# EAGLE design Zio 4 DC Motor Controller (EAGLE 8.4.1)
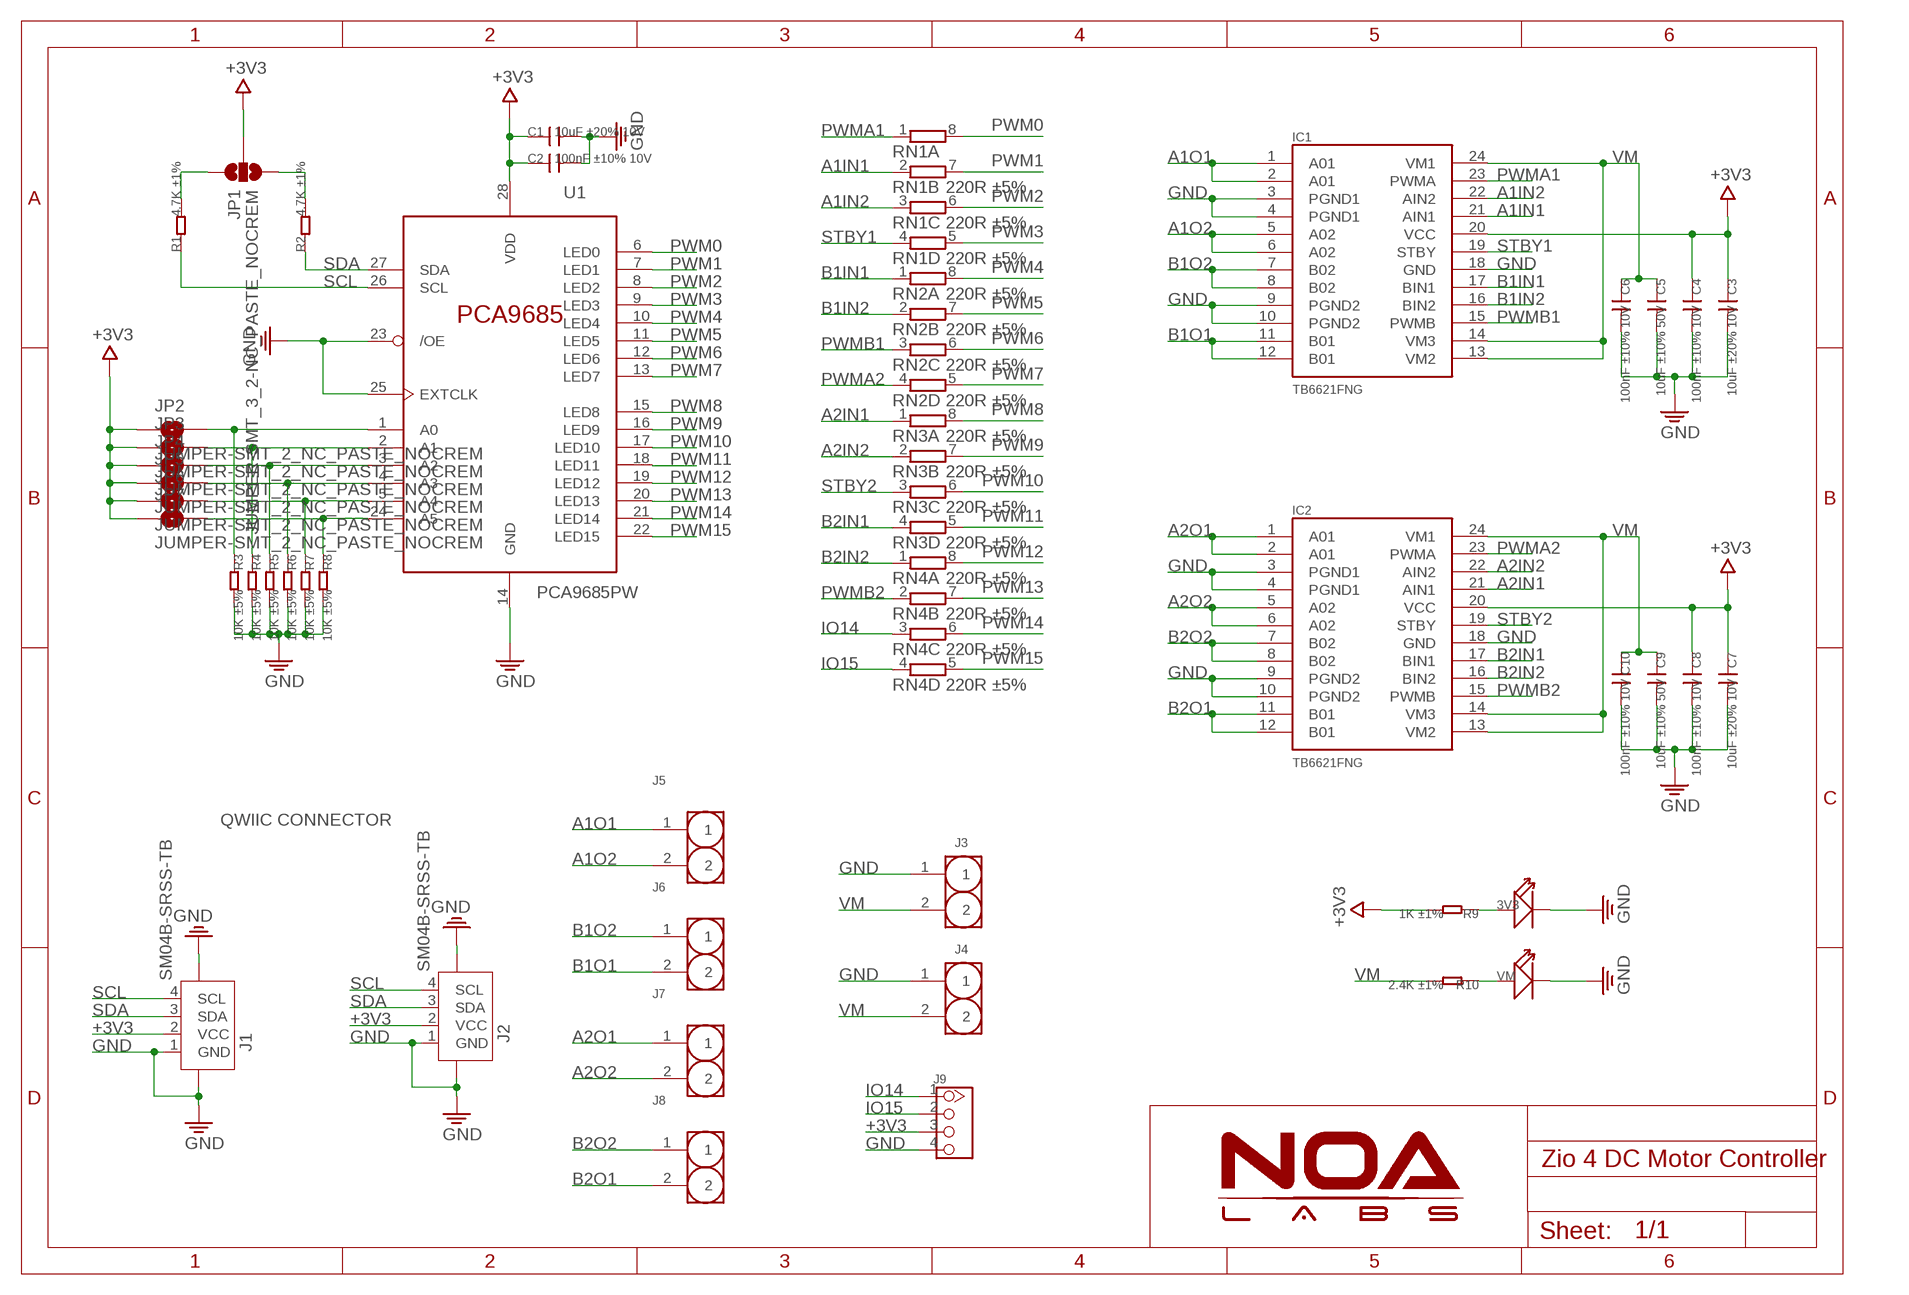
[diagram p0: schematic, sheet 1]

## Parts
3V3  LED'0805'  [LED-0805]
C1  10uF ±20% 10V  C-0603  [0603]
C2  100nF ±10% 10V  C-0603  [0603]
C3  10uF ±20% 10V  C-0603  [0603]
C4  100nF ±10% 10V  C-0603  [0603]
C5  10uF ±10% 50V  C-0805  [0805]
C6  100nF ±10% 10V  C-0603  [0603]
C7  10uF ±20% 10V  C-0603  [0603]
C8  100nF ±10% 10V  C-0603  [0603]
C9  10uF ±10% 50V  C-0805  [0805]
C10  100nF ±10% 10V  C-0603  [0603]
IC1  TB6621FNG  [SSOP24]
IC2  TB6621FNG  [SSOP24]
J1  SM04B-SRSS-TB  JST-SH-4P-1.0  [JST-SH-4P]
J2  SM04B-SRSS-TB  JST-SH-4P-1.0  [JST-SH-4P]
J3  HEADER-2P-2.0-90  [PH2.0-2P-90]
J4  HEADER-2P-2.0-90  [PH2.0-2P-90]
J5  HEADER-2P-SCREW5.0  [2P-SCREW-5.0]
J6  HEADER-2P-SCREW5.0  [2P-SCREW-5.0]
J7  HEADER-2P-SCREW5.0  [2P-SCREW-5.0]
J8  HEADER-2P-SCREW5.0  [2P-SCREW-5.0]
J9  HEADER-4P-80/40MIL  [4P-2.54-80/40MIL]
JP1  JUMPER-SMT_3_2-NC_PASTE_NOCREM  [SMT-JUMPER_3_2-NC_PASTE_SILK_NOCREM]
JP2  JUMPER-SMT_2_NC_PASTE_NOCREM  [SMT-JUMPER_2_NC_PASTE_SILK_NOCREM]
JP3  JUMPER-SMT_2_NC_PASTE_NOCREM  [SMT-JUMPER_2_NC_PASTE_SILK_NOCREM]
JP4  JUMPER-SMT_2_NC_PASTE_NOCREM  [SMT-JUMPER_2_NC_PASTE_SILK_NOCREM]
JP5  JUMPER-SMT_2_NC_PASTE_NOCREM  [SMT-JUMPER_2_NC_PASTE_SILK_NOCREM]
JP6  JUMPER-SMT_2_NC_PASTE_NOCREM  [SMT-JUMPER_2_NC_PASTE_SILK_NOCREM]
JP7  JUMPER-SMT_2_NC_PASTE_NOCREM  [SMT-JUMPER_2_NC_PASTE_SILK_NOCREM]
R1  4.7K ±1%  R-0603  [0603]
R2  4.7K ±1%  R-0603  [0603]
R3  10K ±5%  R-0402  [0402]
R4  10K ±5%  R-0402  [0402]
R5  10K ±5%  R-0402  [0402]
R6  10K ±5%  R-0402  [0402]
R7  10K ±5%  R-0402  [0402]
R8  10K ±5%  R-0402  [0402]
R9  1K ±1%  R-0603  [0603]
R10  2.4K ±1%  R-0603  [0603]
RN1  220R ±5%  RESISTOR-DIL_4R-N0603-ARV  [RESISTOR-DIL_0603-ARV]
RN2  220R ±5%  RESISTOR-DIL_4R-N0603-ARV  [RESISTOR-DIL_0603-ARV]
RN3  220R ±5%  RESISTOR-DIL_4R-N0603-ARV  [RESISTOR-DIL_0603-ARV]
RN4  220R ±5%  RESISTOR-DIL_4R-N0603-ARV  [RESISTOR-DIL_0603-ARV]
U1  PCA9685PW  [TSSOP28]
VM  LED'0805'  [LED-0805]

## Nets
+3V3: C1.1 C2.1 C3.1 C4.1 C7.1 C8.1 IC1.20(VCC) IC2.20(VCC) J1.2(VCC) J2.2(VCC) J9.3 JP1.2 JP2.1 JP3.1 JP4.1 JP5.1 JP6.1 JP7.1 R9.2 U1.28(VDD)
A1IN1: IC1.21(AIN1) RN1.2
A1IN2: IC1.22(AIN2) RN1.3
A1O1: IC1.1(A01) IC1.2(A01) J5.1
A1O2: IC1.5(A02) IC1.6(A02) J5.2
A2IN1: IC2.21(AIN1) RN3.1
A2IN2: IC2.22(AIN2) RN3.2
A2O1: IC2.1(A01) IC2.2(A01) J7.1
A2O2: IC2.5(A02) IC2.6(A02) J7.2
B1IN1: IC1.17(BIN1) RN2.1
B1IN2: IC1.16(BIN2) RN2.2
B1O1: IC1.11(B01) IC1.12(B01) J6.2
B1O2: IC1.7(B02) IC1.8(B02) J6.1
B2IN1: IC2.17(BIN1) RN3.4
B2IN2: IC2.16(BIN2) RN4.1
B2O1: IC2.11(B01) IC2.12(B01) J8.2
B2O2: IC2.7(B02) IC2.8(B02) J8.1
GND: 3V3.- C1.2 C2.2 C3.2 C4.2 C5.2 C6.2 C7.2 C8.2 C9.2 C10.2 IC1.3(PGND1) IC1.4(PGND1) IC1.9(PGND2) IC1.10(PGND2) IC1.18(GND) IC2.3(PGND1) IC2.4(PGND1) IC2.9(PGND2) IC2.10(PGND2) IC2.18(GND) J1.1(GND) J1.NC1 J1.NC2 J2.1(GND) J2.NC1 J2.NC2 J3.1 J4.1 J9.4 R3.2 R4.2 R5.2 R6.2 R7.2 R8.2 U1.14(GND) U1.23(/OE) U1.25(EXTCLK) VM.-
IO14: J9.1 RN4.3
IO15: J9.2 RN4.4
N$1: JP2.2 R3.1 U1.1(A0)
N$2: JP3.2 R4.1 U1.2(A1)
N$3: JP4.2 R5.1 U1.3(A2)
N$4: JP5.2 R6.1 U1.4(A3)
N$5: JP6.2 R7.1 U1.5(A4)
N$6: JP7.2 R8.1 U1.24(A5)
N$7: 3V3.+ R9.1
N$8: R10.1 VM.+
N$9: JP1.1 R1.2
N$10: JP1.3 R2.2
PWM0: RN1.8 U1.6(LED0)
PWM1: RN1.7 U1.7(LED1)
PWM2: RN1.6 U1.8(LED2)
PWM3: RN1.5 U1.9(LED3)
PWM4: RN2.8 U1.10(LED4)
PWM5: RN2.7 U1.11(LED5)
PWM6: RN2.6 U1.12(LED6)
PWM7: RN2.5 U1.13(LED7)
PWM8: RN3.8 U1.15(LED8)
PWM9: RN3.7 U1.16(LED9)
PWM10: RN3.6 U1.17(LED10)
PWM11: RN3.5 U1.18(LED11)
PWM12: RN4.8 U1.19(LED12)
PWM13: RN4.7 U1.20(LED13)
PWM14: RN4.6 U1.21(LED14)
PWM15: RN4.5 U1.22(LED15)
PWMA1: IC1.23(PWMA) RN1.1
PWMA2: IC2.23(PWMA) RN2.4
PWMB1: IC1.15(PWMB) RN2.3
PWMB2: IC2.15(PWMB) RN4.2
SCL: J1.4(SCL) J2.4(SCL) R1.1 U1.26(SCL)
SDA: J1.3(SDA) J2.3(SDA) R2.1 U1.27(SDA)
STBY1: IC1.19(STBY) RN1.4
STBY2: IC2.19(STBY) RN3.3
VM: C5.1 C6.1 C9.1 C10.1 IC1.13(VM2) IC1.14(VM3) IC1.24(VM1) IC2.13(VM2) IC2.14(VM3) IC2.24(VM1) J3.2 J4.2 R10.2

## Notes on the sheet
- QWIIC CONNECTOR

## Library data of the parts
3V3 VM = Discretex:LED*
C1-C10 = Discretex:C*: Ceramic Capacitors
IC1 IC2 = IC:TB6621FNG: Toshiba 1A motor driver
J1 J2 = Connector:JST-SH-4P
J3-J8 = Connector:HEADER-2P
J9 = Connector:HEADER-4P
JP1 = NOA-Jumpers:JUMPER-SMT_3_2-NC_PASTE_NOCREM
JP2-JP7 = NOA-Jumpers:JUMPER-SMT_2_NC_PASTE_NOCREM
R1 R2 R9 R10 = Discretex:R*
R3-R8 = Discrete:R*
RN1-RN4 = A:RESISTOR-DIL_4R-N: Array Chip Resistor Source: RS Component / Phycomp
U1 = IC:PCA9685

## Board
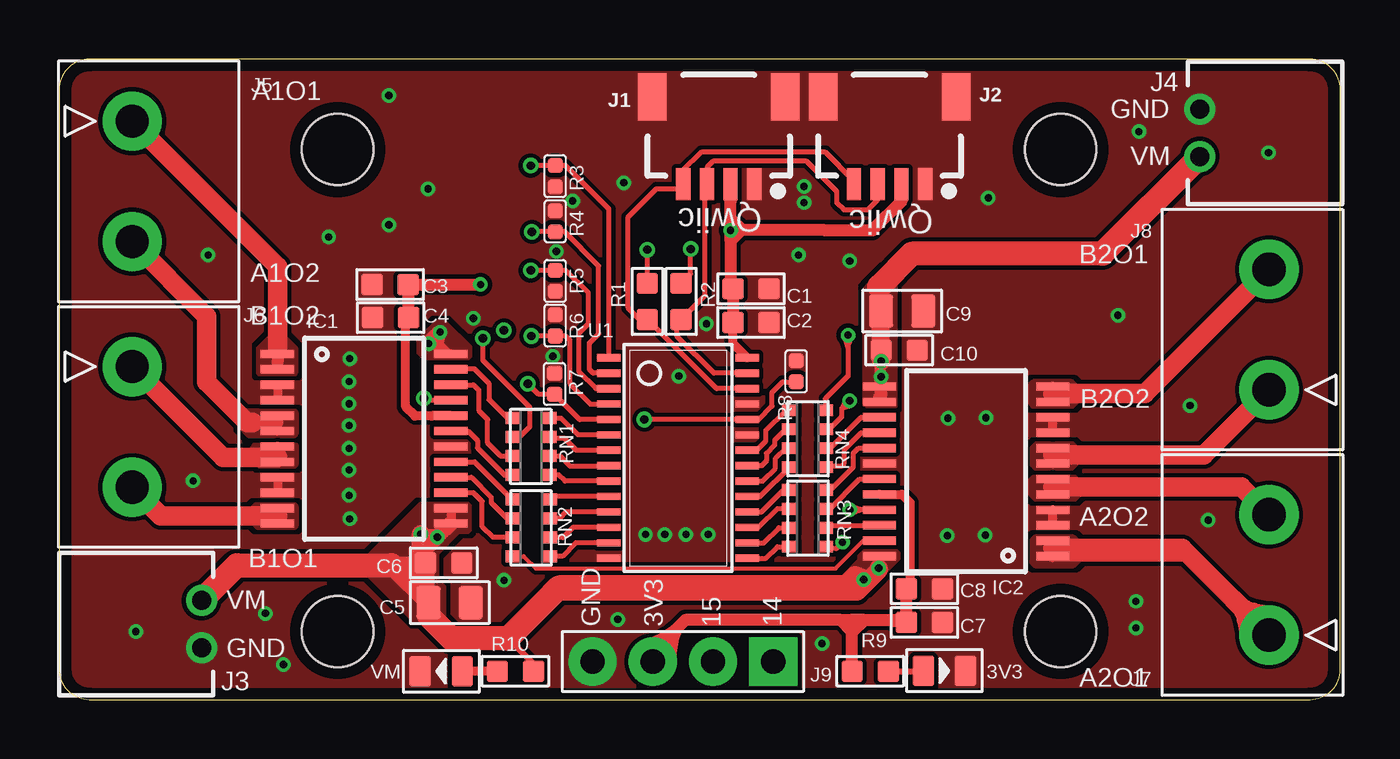
[diagram p1: board, top side]
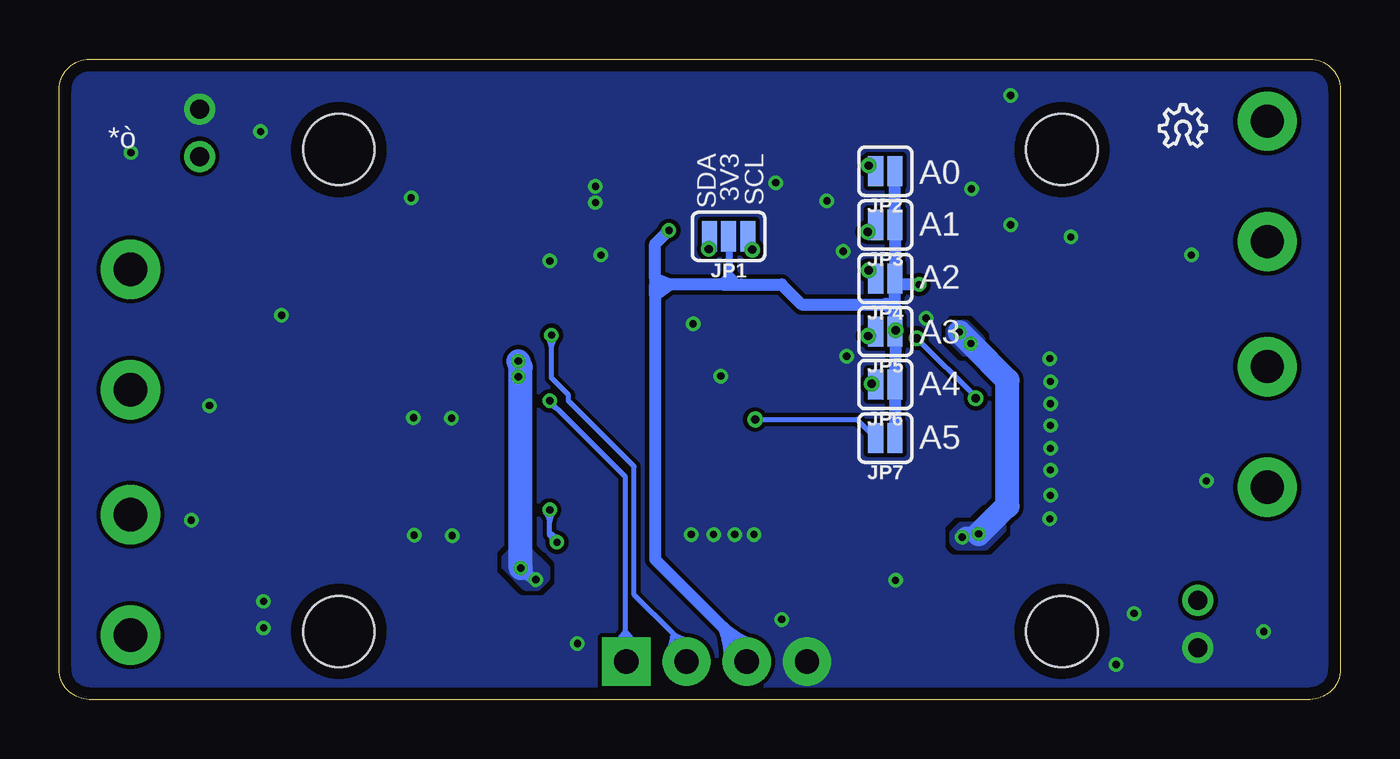
[diagram p2: board, bottom side, seen from below]

Size 54 x 27 mm. Coordinates in mm from the lower left corner, seen from the top.
Outline: 0,25.73 0,1.27 arc90 1.27,0 52.73,0 arc90 54,1.27 54,25.73 arc90 52.73,27 1.27,27 arc90 0,25.73
Copper layers (1*16): Top 0.035mm / dielectric 1.5mm / Bottom 0.035mm
Design rules "NOA Eagle Rule": minimum track width 7mil, minimum drill 12mil, track to track 7mil, track to pad 7mil, pad to pad 7mil, via to via 7mil, smd to smd 0mil, copper to edge 20mil, drill to drill 10mil, minimum pad ring 10mil, minimum via ring 6mil, stop-mask expansion 2mil, vias tented up to drill 25mil, thermal gap 10mil
Holes 3 mm at 11.73,2.87 11.73,23.19 42.21,23.19 42.21,2.87

### Footprints (pad centres in the part's own frame; a part is rotated, then mirrored left to right if it is on the bottom)
LED-0805 = smd 0.889 x 1.27: + -0.889,0; - 0.889,0
0603 = smd 0.889 x 0.889: 1 -0.762,0; 2 0.762,0
0805 = smd 1.016 x 1.397: 1 -0.889,0; 2 0.889,0
SSOP24 = smd 0.348 x 1.397: 1 -3.575,-3.656; 2 -2.925,-3.656; 3 -2.275,-3.656; 4 -1.625,-3.656; 5 -0.975,-3.656; 6 -0.325,-3.656; 7 0.325,-3.656; 8 0.975,-3.656; 9 1.625,-3.656; 10 2.275,-3.656; 11 2.925,-3.656; 12 3.575,-3.656; 13 3.575,3.656; 14 2.925,3.656; 15 2.275,3.656; 16 1.625,3.656; 17 0.975,3.656; 18 0.325,3.656; 19 -0.325,3.656; 20 -0.975,3.656; 21 -1.625,3.656; 22 -2.275,3.656; 23 -2.925,3.656; 24 -3.575,3.656
JST-SH-4P = smd 0.6 x 1.35: 1 1.5,0; 2 0.5,0; 3 -0.5,0; 4 -1.5,0 | smd 1.2 x 2: NC1 -2.8,3.675; NC2 2.8,3.675
PH2.0-2P-90 = drill 0.8: 1 -1,0; 2 1,0
2P-SCREW-5.0 = drill 1.4 pad 2.5: 1 -2.54,0; 2 2.54,0
4P-2.54-80/40MIL = drill 1.016 pad 2.032 square: 1 0,3.81 | drill 1.016 pad 2.032: 2 0,1.27; 3 0,-1.27; 4 0,-3.81
SMT-JUMPER_3_2-NC_PASTE_SILK_NOCREM = smd 0.635 x 1.27: 1 -0.813,0; 2 0,0; 3 0.813,0
SMT-JUMPER_2_NC_PASTE_SILK_NOCREM = smd 0.635 x 1.27: 1 -0.406,0; 2 0.406,0
0402 = smd 0.635 x 0.635: 1 -0.445,0; 2 0.445,0
RESISTOR-DIL_0603-ARV = smd 0.5 x 0.65: 1 -1.2,-0.752; 2 -0.4,-0.752; 3 0.4,-0.752; 4 1.2,-0.752; 5 1.2,0.752; 6 0.4,0.752; 7 -0.4,0.752; 8 -1.2,0.752
TSSOP28 = smd 0.305 x 0.991: 1 -4.225,-2.918; 2 -3.575,-2.918; 3 -2.925,-2.918; 4 -2.275,-2.918; 5 -1.625,-2.918; 6 -0.975,-2.918; 7 -0.325,-2.918; 8 0.325,-2.918; 9 0.975,-2.918; 10 1.625,-2.918; 11 2.275,-2.918; 12 2.925,-2.918; 13 3.575,-2.918; 14 4.225,-2.918; 15 4.225,2.918; 16 3.575,2.918; 17 2.925,2.918; 18 2.275,2.918; 19 1.625,2.918; 20 0.975,2.918; 21 0.325,2.918; 22 -0.325,2.918; 23 -0.975,2.918; 24 -1.625,2.918; 25 -2.275,2.918; 26 -2.925,2.918; 27 -3.575,2.918; 28 -4.225,2.918

### Placement (x,y rotation side)
3V3  37.31,1.22 0 top
C1  29.16,17.32 0 top
C2  29.16,15.9 0 top
C3  13.94,17.5 180 top
C4  13.97,16.1 180 top
C5  16.46,4.09 0 top
C6  16.21,5.77 0 top
C7  36.47,3.25 0 top
C8  36.47,4.67 0 top
C9  35.53,16.38 0 top
C10  35.41,14.73 0 top
E$11  [10MM]  24.31,21.29 0 bottom
IC1  12.85,11 270 top
IC2  38.23,9.63 90 top
J1  27.8,21.74 0 top
J2  35,21.74 0 top
J3  5.99,3.17 90 top
J4  48.08,23.9 270 top
J5  3.07,21.85 270 top
J6  3.07,11.5 270 top
J7  51,5.26 90 top
J8  51,15.6 90 top
J9  26.29,1.6 270 top
JP1  25.78,19.53 180 bottom
JP2  19.18,22.28 180 bottom
JP3  19.18,20.02 180 bottom
JP4  19.18,17.75 180 bottom
JP5  19.18,15.52 180 bottom
JP6  19.18,13.28 180 bottom
JP7  19.18,11.02 180 bottom
LOGO1  LOGO-OSHW-6MILX0070-NT  [OSHW_6X70_NOTEXT]  7.62,23.31 0 bottom
R1  24.79,16.79 90 top
R2  26.21,16.79 90 top
R3  20.9,22.07 270 top
R4  20.9,20.17 90 top
R5  20.9,17.65 270 top
R6  20.9,15.77 90 top
R7  20.88,13.31 90 top
R8  31.06,13.84 90 top
R9  34.19,1.19 180 top
R10  19.23,1.19 0 top
RN1  19.89,10.67 270 top
RN2  19.9,7.24 270 top
RN3  31.55,7.65 90 top
RN4  31.55,11 90 top
U1  26.09,10.19 270 top
U$5  [6MM]  38.35,16.28 0 top
VM  16.1,1.19 180 top

### Tracks (layer width: path | path; a pad name or v marks a point on that pad's centre or on a via)
+3V3  (via drill 0.3, 0.35)
  Top 0.254: 33.43,1.55 R9.2 | 35.08,3.2 35.66,3.2 C7.1
  Top 0.381: U1.28 28.4,15.02 C2.1 | IC2.20 35.52,8.65 35.87,8.31 35.87,4.83 C8.1 | IC1.20 15.72,11.97 15.7,11.95 15,11.95 14.61,12.34 14.61,15.98 C4.1 | 28.3,20.68 28.3,20.95 J1.2 | 32.23,19.76 32.26,19.79
  Top 0.508: C2.1 C1.1 28.3,17.42 28.3,19.33 | C8.1 C7.1 35.61,3.35 33.93,3.35 | C4.1 14.73,17.48 C3.1 v17.75,17.5 | 28.3,20.27 v28.3,19.79 | 28.3,20.27 J1.2 28.3,20.95 | 28.3,19.33 v28.3,19.79 | J2.2 35.5,21 34.29,19.79 32.26,19.79 28.78,19.79 | 28.76,19.79 v28.3,19.79 | 28.78,19.79 28.3,20.27 | 28.78,19.79 28.76,19.79 | 28.76,19.79 28.3,19.33 | J9.3 25.02,1.98 26.04,3 | 26.04,3 26.39,3.35 32.94,3.35 | 32.94,3.35 33.35,3.35 | 33.78,3.35 33.35,3.35 | 33.93,3.35 33.78,3.35 | 33.43,3 33.43,3.28 33.35,3.35 | 33.43,2.87 33.43,3 | 33.43,3 33.78,3.35 | 33.43,2.85 33.43,2.87 | 33.43,2.87 32.94,3.35 | 33.43,2.85 33.93,3.35 | R9.2 33.43,2.85 | 26.04,3 arc-29 24.66,2.27 J9.3 | 26.04,3 arc29 25.77,1.47 J9.3
  Bottom 0.305: 25.76,17.5 25.76,17.93 | 25.76,17.93 26.04,17.65 26.04,17.5 | 25.76,17.93 25.32,17.5 25.25,17.5 | JP1.2 25.76,19.51 25.76,17.93
  Bottom 0.381: v18.75,15.57 JP5.1 | 18.8,15.54 JP5.1 | 18.77,17.48 18.8,17.5 | JP5.1 18.77,15.6 18.8,15.62
  Bottom 0.508: 18.8,17.5 18.8,16.61 | 18.8,16.38 18.8,16.61 | 18.8,15.62 18.8,16.38 | v18.75,15.57 JP6.1 JP7.1 | J9.3 25.02,2.06 25.99,3.03 | 25.99,3.03 28.88,5.92 28.88,17.04 | 28.88,17.04 28.88,17.5 | 28.25,17.5 26.04,17.5 25.76,17.5 25.25,17.5 23.55,17.5 22.71,16.66 19.18,16.66 | 28.25,17.5 28.88,17.5 | v28.3,19.79 28.88,19.21 28.88,17.75 | 28.88,17.75 28.88,17.5 | 28.25,17.5 28.88,17.75 | 28.25,17.5 28.88,17.04 | 25.99,3.03 arc-29 24.64,2.26 J9.3 | 25.99,3.03 arc29 25.77,1.49 J9.3 | v17.75,17.5 18.8,17.5 | 19.07,16.66 18.85,16.66 18.8,16.61 | 19.18,16.66 19.15,16.69 19.11,16.69 | 19.18,16.66 19.07,16.66 | 19.07,16.66 18.8,16.38 | JP2.1 JP3.1 JP4.1 18.8,17.73 18.8,17.5 | 19.18,16.66 19.13,16.61 18.8,16.61
A1IN1  (via drill 0.35)
  Top 0.203: RN1.2 19.4,11.07 19.84,11.51 19.84,12.32 17.86,14.3 v17.86,15.24 | v15.37,12.7 15.44,12.62 IC1.21
  Bottom 0.203: v17.86,15.24 15.37,12.75 v15.37,12.7
A1IN2
  Top 0.203: IC1.22 17.46,13.27 17.68,13.06 17.68,12.19 18.06,11.81 18.06,10.82 18.61,10.27 RN1.3
A1O1
  Top 0.381: IC1.2 9.2,14.22 IC1.1
  Top 0.508: 9.2,14.78 9.2,14.22
  Top 0.813: J5.1 9.2,18.26 9.2,14.78
  pour Top (no thermals): 9.91,13.72 9.98,13.79 9.98,14.78 9.37,15.39 8.99,15.39 8.38,14.78 8.38,13.79 8.46,13.72
A1O2
  Top 0.381: IC1.6 9.2,11.68 IC1.5
  Top 0.508: 8.15,11.68 9.2,11.68
  Top 0.813: J5.2 6.22,16.16 6.22,13.39 7.92,11.68 8.15,11.68
  pour Top (no thermals): 7.7,12.19 9.91,12.19 9.98,12.12 9.98,11.2 9.91,11.13 8,11.13 7.62,11.51 7.62,12.04 7.62,12.12
A2IN1  (via drill 0.3)
  Top 0.203: IC2.21 33.84,8 | 33.84,8 v33.33,8 | 33.84,8 arc-29 33.4,8.19 v33.33,8 | 33.84,8 arc29 33.41,7.81 v33.33,8 | RN3.1 32.76,6.37 v33.02,6.63
  Bottom 0.203: v33.02,6.63 33.33,6.93 33.33,7.05 | 33.33,7.05 33.33,7.48 | 33.33,7.48 v33.33,8 | 33.33,7.48 arc-29 33.51,7.92 v33.33,8 | 33.33,7.48 arc29 33.14,7.92 v33.33,8 | 33.33,7.05 arc-29 32.92,6.8 v33.02,6.63 | 33.33,7.05 arc29 33.22,6.58 v33.02,6.63
A2IN2
  Top 0.203: RN3.2 32.32,7.35 IC2.22
A2O1
  Top 0.381: IC2.2 41.88,6.38 IC2.1
  Top 0.508: 47.67,6.05 IC2.1 | 47.67,6.05 49.5,4.22 | 47.34,6.38 47.67,6.05 | 49.5,4.22 arc-29 50.05,2.43 J7.1 51.29,3.67 arc-29 49.5,4.22
  Top 0.813: J7.1 49.5,4.22 47.34,6.38 41.88,6.38
  pour Top (no thermals): 43.13,6.48 42.75,6.86 41.22,6.86 41.15,6.86 41,6.71 41,5.87 41,5.79 41.15,5.64 42.75,5.64 43.13,6.02
A2O2
  Top 0.381: IC2.6 41.88,8.97 IC2.5
  Top 0.813: J7.2 49.83,8.97 41.88,8.97
  pour Top (no thermals): 43.13,9.07 42.82,9.37 41.07,9.37 40.92,9.22 40.92,8.69 41.15,8.46 42.82,8.46 43.13,8.76
B1IN1
  Top 0.203: IC1.17 17.51,10.02 19.09,8.44 RN2.1
  Top 0.254: 16.79,10.03 16.52,10.03 IC1.17
B1IN2
  Top 0.203: IC1.16 17.37,9.37 18.21,8.53 18.21,8.31 18.88,7.64 RN2.2
B1O1
  Top 0.381: IC1.12 9.2,7.75 IC1.11
  Top 0.813: J6.2 4.28,7.75 9.2,7.75
  pour Top (no thermals): 8,7.92 8.31,8.23 9.91,8.23 9.98,8.15 9.98,7.32 9.91,7.24 8.46,7.24 8.38,7.24 8,7.62
B1O2
  Top 0.381: IC1.8 9.2,10.21 IC1.7
  Top 0.813: 9.2,10.21 6.9,10.21 J6.1
  pour Top (no thermals): 8,10.44 8.23,10.74 9.98,10.74 9.98,9.91 9.91,9.83 8.46,9.83 8,10.29
B2IN1
  Top 0.203: RN3.4 32.52,8.85 33.48,9.8 33.48,10.39 33.69,10.6 IC2.17
B2IN2
  Top 0.203: 32.49,9.82 RN4.1 32.36,9.86 32.99,9.86 33.1,9.96 33.1,10.55 33.8,11.25 IC2.16 33.91,11.25
B2O1
  Top 0.381: IC2.12 41.88,12.9 IC2.11
  Top 0.813: J8.2 45.76,12.9 41.88,12.9
  pour Top (no thermals): 43.05,13.03 42.67,13.41 41.22,13.41 41.07,13.41 40.92,13.26 40.92,12.57 40.92,12.5 41.07,12.34 42.67,12.34 43.05,12.73
B2O2
  Top 0.381: IC2.8 41.88,10.31 IC2.7
  Top 0.813: J8.1 48.25,10.31 41.88,10.31
  pour Top (no thermals): 43.05,10.44 42.67,10.82 41.22,10.82 41,10.59 41,9.91 41.15,9.75 42.67,9.75 43.05,10.13
GND  (via drill 0.3)
  Top 0.203: C3.2 13.26,17.58
  Top 0.381: IC1.3 IC1.4 | IC1.9 IC1.10 | IC2.3 IC2.4 | IC2.9 IC2.10
  other vias: 20.8,14.48 21.64,21.03 31.39,21.64 31.39,20.95 18.75,5.03 17.45,16.08 32.16,2.36 20.95,18.9 27.28,15.85 23.8,21.79 15.54,21.54 13.89,20.02 11.35,19.51 13.89,25.48 26.11,13.64 27.36,6.96 23.55,3.38 8.69,3.63 9.45,1.47 12.22,8.61 12.24,14.38 5.64,9.22 45.39,4.14 45.39,3.02 37.47,11.86 39.04,6.93 44.63,16.21 50.98,23.06 45.52,23.95 39.17,21.16 33.32,18.49 31.17,18.75 6.27,18.75 47.68,12.4 48.44,7.57 3.23,2.87 26.42,6.96 25.53,6.96 24.71,6.96 37.44,6.91 39.07,11.89 12.22,13.41 12.22,12.47 12.22,11.56 12.22,10.59 12.22,9.68 12.24,7.62
  pour Top (rank 2, no thermals): -0.08,26.97 -0.08,-0.08 54.1,-0.08 54.1,26.97
  pour Bottom (rank 2, no thermals): -0.08,26.97 -0.08,-0.08 54.1,-0.08 54.1,26.97
IO14  (via drill 0.3)
  Top 0.203: 32.43,11.42 RN4.3 32.33,11.4 32.34,11.4 32.48,11.4 32.98,11.91 32.98,12.26 | 32.98,12.26 v33.33,12.6 | 32.98,12.26 arc-29 33.32,12.38 v33.33,12.6 | 32.98,12.26 arc29 33.16,12.7 v33.33,12.6
  Bottom 0.203: v33.33,12.6 33.35,12.6 33,12.24 | 30.15,2.92 30.15,1.65 J9.1 | 33,12.24 arc-29 33.43,12.44 v33.33,12.6 | 33,12.24 arc29 33.01,12.26 v33.33,12.6 | 30.15,2.92 arc-29 29.46,2.26 J9.1 | 30.15,2.92 arc29 30.78,2.21 J9.1 | 33,12.24 30.15,9.4 30.15,2.92
IO15  (via drill 0.3)
  Top 0.203: 32.37,12.22 RN4.4 32.3,12.69 33.25,13.64 33.25,14.85 | 33.25,14.85 v33.25,15.37 | 33.25,14.85 arc-29 33.44,15.29 v33.25,15.37 | 33.25,14.85 arc29 33.06,15.29 v33.25,15.37
  Bottom 0.203: 33.25,14.85 v33.25,15.37 | J9.2 27.56,2.21 28.14,2.79 | 28.14,2.79 29.77,4.42 29.77,9.83 32.54,12.6 32.54,12.85 33.25,13.56 33.25,14.85 | 33.25,14.85 arc-29 33.44,15.29 v33.25,15.37 | 33.25,14.85 arc29 33.06,15.29 v33.25,15.37 | 28.14,2.79 arc-29 27.24,2.46 J9.2 | 28.14,2.79 arc29 28.43,1.88 J9.2
N$1  (via drill 0.35)
  Top 0.203: v19.88,22.52 R3.1 21.34,22.52 23.17,20.68 U1.1
  Bottom 0.508: v19.88,22.52 19.82,22.52 JP2.2
N$2  (via drill 0.35)
  Top 0.203: U1.2 22.51,13.76 22.35,13.92 22.35,15.04 22.74,15.42 22.74,18.29 21.3,19.72 R4.1 v19.93,19.72
  Bottom 0.508: v19.93,19.72 19.88,19.72 JP3.2
N$3  (via drill 0.35)
  Top 0.203: v19.88,18.1 R5.1 21.35,18.1 22.3,17.14 22.3,15.85 21.92,15.46 21.92,13.81 22.62,13.11 U1.3
  Bottom 0.508: v19.88,18.1 19.88,18.05 JP4.2
N$4  (via drill 0.35)
  Top 0.203: U1.4 22.39,12.46 21.51,13.34 21.51,15.16 21.35,15.33 R6.1 v19.9,15.33
  Bottom 0.508: v19.9,15.33 19.77,15.33 JP5.2
N$5  (via drill 0.35)
  Top 0.203: U1.5 21.93,11.81 R7.1 20.21,12.87 v19.75,13.32
  Bottom 0.152: 19.62,13.32 v19.75,13.32
  Bottom 0.508: v19.75,13.32 19.71,13.28 JP6.2
N$6  (via drill 0.35)
  Top 0.203: 29.46,11.81 U1.24 | U1.24 v24.66,11.81 | U1.24 29.48,11.81 | U1.24 29.49,11.81 30.05,12.37 30.05,12.95 30.49,13.4 R8.1
  Bottom 0.203: v24.66,11.81 20.37,11.81 JP7.2
N$7
  Top 0.254: R9.1 36.4,1.19 3V3.+
N$8
  Top 0.381: R10.1 VM.+
N$9  (via drill 0.35)
  Top 0.203: R1.2 v24.79,18.97
  Bottom 0.203: v24.79,18.97 24.79,19.36 JP1.1
N$10  (via drill 0.35)
  Top 0.203: R2.2 26.62,17.96 v26.62,19
  Bottom 0.203: JP1.3 26.62,19.51 v26.62,19
PWM0
  Top 0.203: U1.6 21.86,11.16 21.16,11.86 20.52,11.86 RN1.8
PWM1
  Top 0.203: U1.7 21.8,10.51 21.3,11.01 20.57,11.01 RN1.7
PWM2
  Top 0.203: RN1.6 21.1,10.27 21.51,9.86 U1.8
PWM3
  Top 0.203: U1.9 21.32,9.21 21.06,9.47 20.52,9.47 RN1.5
PWM4
  Top 0.203: U1.10 20.65,8.56 RN2.8
PWM5
  Top 0.203: 23.15,7.89 U1.11 21.35,7.91 21.08,7.64 20.53,7.64 RN2.7
PWM6
  Top 0.203: U1.12 21.66,7.26 21.23,6.83 20.53,6.83 RN2.6
PWM7
  Top 0.203: U1.13 21.77,6.61 21.21,6.04 20.53,6.04 RN2.5
PWM8
  Top 0.203: U1.15 29.02,5.94 29.77,5.94 30.27,6.45 RN3.8
PWM9
  Top 0.203: 29.4,6.61 U1.16 29.69,6.6 30.33,7.25 RN3.7
PWM10
  Top 0.203: RN3.6 30.27,8.04 29.48,7.26 U1.17
PWM11
  Top 0.203: 29.5,7.91 U1.18 29.6,7.91 30.53,8.85 RN3.5 30.99,8.76
PWM12
  Top 0.203: 30.83,9.82 RN4.8 30.78,9.8 29.54,8.56 U1.19
PWM13
  Top 0.203: 30.83,10.62 RN4.7 30.62,10.6 30.19,10.16 30.19,9.75 29.65,9.21 U1.20 | 29.41,9.21 U1.20 | U1.20 29.02,9.2
PWM14
  Top 0.203: 30.71,11.4 30.98,11.4 RN4.6 30.68,11.28 30.51,11.28 30.16,10.93 30.16,10.73 29.81,10.38 29.81,10.06 29.61,9.86 U1.21
PWM15
  Top 0.203: 30.72,12.22 RN4.5 30.62,12.2 29.78,11.35 29.78,10.89 29.4,10.51 | 29.4,10.51 U1.22 29.4,10.51
PWMA1
  Top 0.203: 16.53,13.95 17.5,13.95 18.11,13.34 18.11,12.65 18.89,11.87 RN1.1
  Top 0.254: 16.53,13.95 IC1.23
PWMA2
  Top 0.178: RN2.4 19.57,6.04 20.09,5.52 32.72,5.52 33.9,6.7 IC2.23
PWMB1
  Top 0.203: IC1.15 17.46,8.72 17.83,8.36 17.83,7.29 18.28,6.84 RN2.3
  Top 0.254: IC1.15
PWMB2
  Top 0.203: 32.52,10.62 RN4.2 32.49,10.6 33.8,11.9 IC2.15
SCL
  Top 0.203: 26.28,21.72 26.1,21.54 25.17,21.54 23.98,20.34 23.98,16.51 24.46,16.03 R1.1 27.71,13.11 U1.26 | 26.28,21.72 J1.4 | J2.4 33.5,21.87 32.29,23.08 27.07,23.08 26.28,22.29 26.28,21.72
SDA
  Top 0.203: J2.3 34.5,21.06 34.09,20.65 33.07,20.65 32.78,20.94 32.78,21.43 31.51,22.7 27.55,22.7 27.33,22.48 27.33,21.77 J1.3 27.23,21.67 27.23,17.04 R2.1 26.05,16.03 26.05,15.31 27.6,13.76 U1.27
STBY1
  Top 0.203: IC1.19 17.23,11.32 17.63,10.92 17.63,10.61 18.77,9.47 RN1.4
STBY2
  Top 0.203: IC2.19 33.74,9.3 32.48,8.04 RN3.3 32.42,7.97
VM  (via drill 0.3)
  Top 0.203: 20.74,4.41 20.74,4.14 20.47,4.14
  Top 0.254: R10.2 19.99,1.5 18.91,2.58 | 15.57,3.53 C5.1
  Top 0.381: IC2.14 34.57,12.75 34.57,13.1 | 34.57,13.1 IC2.13 34.57,13.76 | 34.57,13.76 34.57,14.13 | 34.57,14.13 34.57,14.66 C10.1 | 34.65,16.18 C9.1 | IC1.14 IC1.13 | 19.99,1.22 R10.2 | v34.54,5.54 34.54,6.03 IC2.24 | IC1.24 16.41,14.57 16.08,14.91 | 16.08,14.91 16.01,14.98 | 16.01,14.98 15.77,15.21 | 34.57,13.76 arc-29 34.75,14.23 v34.65,14.28 34.53,14.27 arc-29 34.57,13.76 | 34.57,13.1 arc-29 34.75,13.57 v34.65,13.61 | 34.57,13.1 arc29 34.53,13.61 v34.65,13.61 | 34.57,14.13 arc-29 34.53,13.62 v34.65,13.61 | 34.57,14.13 arc29 34.75,13.65 v34.65,13.61 | 16.08,14.91 arc-29 15.62,15.12 v15.57,15.01 15.57,14.9 arc-29 16.08,14.91 | 16.01,14.98 arc-29 16.16,15.46 v16.05,15.49 15.94,15.48 arc-29 16.01,14.98
  Top 0.508: 15.57,4.72 15.57,5.64 C6.1 15.44,6.36 | C10.1 34.65,16.18 | v34.65,13.61 34.65,12.82 34.57,12.75 | v33.91,5.05 34.52,5.54 v34.54,5.54 | 14.63,5.66 15.57,4.72 | 15.57,4.72 C5.1
  Top 0.635: IC1.13 v15.93,6.85 | v15.93,6.85 15.44,6.36 | v15.93,6.85 15.38,6.85 v15.24,6.99 | v15.57,15.01 15.77,15.21 v16.05,15.49
  Top 0.762: v34.54,5.54 34.54,5.46 33.63,4.55 20.88,4.55 20.74,4.41 | C5.1 13.99,5.66 15.34,5.66 C6.1 15.24,5.97 v15.24,6.99 | v34.65,14.28 C10.1 C9.1 34.57,16.46 34.57,17.42
  Top 0.889: v33.91,5.05 33.55,5.18 33.09,4.72
  Top 1.016: J4.2 43.98,18.8 35.94,18.8 34.57,17.42 | J3.2 7.48,5.66 13.99,5.66 | 20.74,4.41 21.06,4.72 33.09,4.72 | 20.88,4.55 20.47,4.14 18.91,2.58 16.52,2.58 15.57,3.53
  Bottom 0.508: v34.65,14.28 v34.65,13.61 | v34.54,5.54 34.27,5.26 34.24,5.26 v33.91,5.05
  Bottom 0.635: v15.24,6.99 15.8,6.99 v15.93,6.85 | 14.61,14.05 15.54,14.99 v15.57,15.01
  Bottom 1.016: v34.54,5.54 34.54,14.02 v34.65,14.28 | v16.05,15.49 15.54,14.99 14.02,13.46 14.02,8.15 14.07,8.15 v15.24,6.99
  pour Top (no thermals): 35.26,12.4 35.26,17.78 34.85,18.19 34.04,17.37 33.93,17.27 33.93,12.5 34.04,12.4
  pour Bottom (no thermals): 34.24,6.4 33.43,5.59 33.43,5.08 33.83,4.67 34.34,4.67 35.26,5.59 35.26,5.99 34.85,6.4
  pour Top (no thermals): 17.22,8.23 15.24,8.23 12.95,5.94 12.95,5.33 15.01,3.28 16.23,3.28 16.23,4.72 15.93,5.03 15.93,6.17 16.84,7.09 17.22,7.09 17.3,7.16 17.3,8.15
  pour Bottom (no thermals): 14.86,7.92 15.39,7.39 16,7.39 16.38,7.01 16.38,6.71 16.38,6.63 16.15,6.4 14.94,6.4 14.17,7.16 14.17,7.77 14.33,7.92
  pour Bottom (no thermals): 15.47,14.55 15.85,14.55 16.54,15.24 16.54,15.54 16.54,15.62 16.23,15.93 15.77,15.93 15.16,15.32 15.09,15.24 15.09,14.86 15.39,14.55
  pour Top (no thermals): 17.22,14.4 15.39,14.4 15.16,14.63 15.16,15.16 15.93,15.93 16.23,15.93 17.3,14.86 17.3,14.48
  pour Top (no thermals): 33.91,6.25 35.28,6.25 35.36,6.17 35.36,5.94 35.28,5.87 33.99,4.57 33.53,4.57 33.38,4.72 33.38,5.49 33.76,5.87 33.76,6.1

### Text on the board
tPlace: A1O1 | GND | VM | Qwiic | Qwiic | B2O1 | A1O2 | B1O2 | B2O2 | A2O2 | B1O1 | VM | GND | 3V3 | 15 | 14 | GND | A2O1
bPlace: SCL | 3V3 | SDA | *ò | A0 | A1 | A2 | A3 | A4 | A5
bDocu: Zio 4 DC Motor Controller V1.0 / VM 2.5 to 13.5V / 1.2A Continuous, 3.2A Peak / TB6612FNG